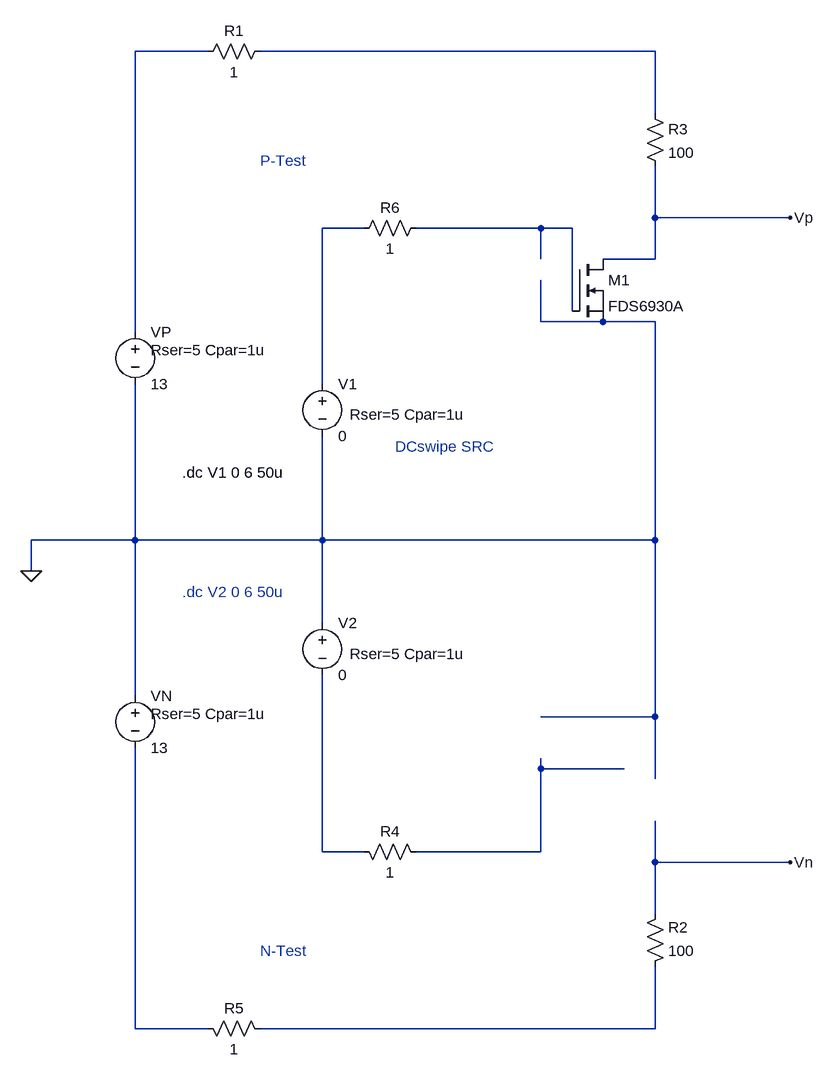
[diagram p0: schematic V0_MTEST.asc]
V0_MTEST.asc, the LTspice schematic file:
Version 4
SHEET 1 1452 680
WIRE -736 -1152 -848 -1152
WIRE -48 -1152 -656 -1152
WIRE -48 -1056 -48 -1152
WIRE -48 -896 -48 -976
WIRE 160 -896 -48 -896
WIRE -496 -880 -560 -880
WIRE -224 -880 -416 -880
WIRE -176 -880 -224 -880
WIRE -224 -832 -224 -880
WIRE -48 -832 -48 -896
WIRE -48 -832 -128 -832
WIRE -176 -752 -176 -880
WIRE -224 -736 -224 -800
WIRE -128 -736 -128 -768
WIRE -128 -736 -224 -736
WIRE -48 -736 -128 -736
WIRE -848 -720 -848 -1152
WIRE -560 -640 -560 -880
WIRE -848 -400 -848 -640
WIRE -848 -400 -1008 -400
WIRE -560 -400 -560 -560
WIRE -560 -400 -848 -400
WIRE -48 -400 -48 -736
WIRE -48 -400 -560 -400
WIRE -1008 -352 -1008 -400
WIRE -560 -272 -560 -400
WIRE -848 -160 -848 -400
WIRE -48 -128 -48 -400
WIRE -48 -128 -224 -128
WIRE -224 -48 -224 -64
WIRE -96 -48 -224 -48
WIRE -48 -32 -48 -128
WIRE -560 80 -560 -192
WIRE -496 80 -560 80
WIRE -224 80 -224 -48
WIRE -224 80 -416 80
WIRE -48 96 -48 32
WIRE 160 96 -48 96
WIRE -48 176 -48 96
WIRE -848 352 -848 -80
WIRE -736 352 -848 352
WIRE -48 352 -48 256
WIRE -48 352 -656 352
FLAG 160 -896 Vp
FLAG -1008 -352 0
FLAG 160 96 Vn
SYMBOL res -64 -1072 R0
SYMATTR InstName R3
SYMATTR Value 100
SYMBOL res -400 -896 R90
WINDOW 0 0 56 VBottom 2
WINDOW 3 32 56 VTop 2
SYMATTR InstName R6
SYMATTR Value 1
SYMBOL voltage -848 -736 R0
WINDOW 123 0 0 Left 0
WINDOW 39 24 44 Left 2
SYMATTR SpiceLine Rser=5 Cpar=1u
SYMATTR InstName VP
SYMATTR Value 13
SYMBOL res -640 -1168 R90
WINDOW 0 0 56 VBottom 2
WINDOW 3 32 56 VTop 2
SYMATTR InstName R1
SYMATTR Value 1
SYMBOL res -64 272 M180
WINDOW 0 36 76 Left 2
WINDOW 3 36 40 Left 2
SYMATTR InstName R2
SYMATTR Value 100
SYMBOL voltage -560 -656 R0
WINDOW 123 0 0 Left 0
WINDOW 39 42 63 Left 2
SYMATTR SpiceLine Rser=5 Cpar=1u
SYMATTR InstName V1
SYMATTR Value 0
SYMBOL res -400 96 M270
WINDOW 0 32 56 VTop 2
WINDOW 3 0 56 VBottom 2
SYMATTR InstName R4
SYMATTR Value 1
SYMBOL voltage -848 -176 R0
WINDOW 123 0 0 Left 0
WINDOW 39 24 44 Left 2
SYMATTR SpiceLine Rser=5 Cpar=1u
SYMATTR InstName VN
SYMATTR Value 13
SYMBOL res -640 368 M270
WINDOW 0 32 56 VTop 2
WINDOW 3 0 56 VBottom 2
SYMATTR InstName R5
SYMATTR Value 1
SYMBOL voltage -560 -288 R0
WINDOW 123 0 0 Left 0
WINDOW 39 42 63 Left 2
SYMATTR SpiceLine Rser=5 Cpar=1u
SYMATTR InstName V2
SYMATTR Value 0
SYMBOL nmos -176 -832 R0
SYMATTR InstName M1
SYMATTR Value FDS6930A
TEXT -656 -984 Left 2 ;P-Test
TEXT -448 -544 Left 2 ;DCswipe SRC
TEXT -776 -504 Left 2 !.dc V1 0 6 50u
TEXT -656 232 Left 2 ;N-Test
TEXT -776 -320 Left 2 ;.dc V2 0 6 50u

The netlist it stands for:
* V0_MTEST.asc
R3 N002 Vp 100
R6 N004 N003 1
VP N001 0 13 Rser=5 Cpar=1u
R1 N002 N001 1
R2 N008 Vn 100
V1 N003 0 0 Rser=5 Cpar=1u
R4 N005 N006 1
VN 0 N007 13 Rser=5 Cpar=1u
R5 N008 N007 1
V2 0 N006 0 Rser=5 Cpar=1u
M1 Vp N004 0 0 FDS6930A
.model NMOS NMOS
.model PMOS PMOS
.lib standard.mos
* P-Test
* DCswipe SRC
.dc V1 0 6 50u
* N-Test
* .dc V2 0 6 50u
.backanno
.end